# Altium schematic sheet ETHERNET.SchDoc
size A3; SheetNumber: 5; SheetTotal: 6
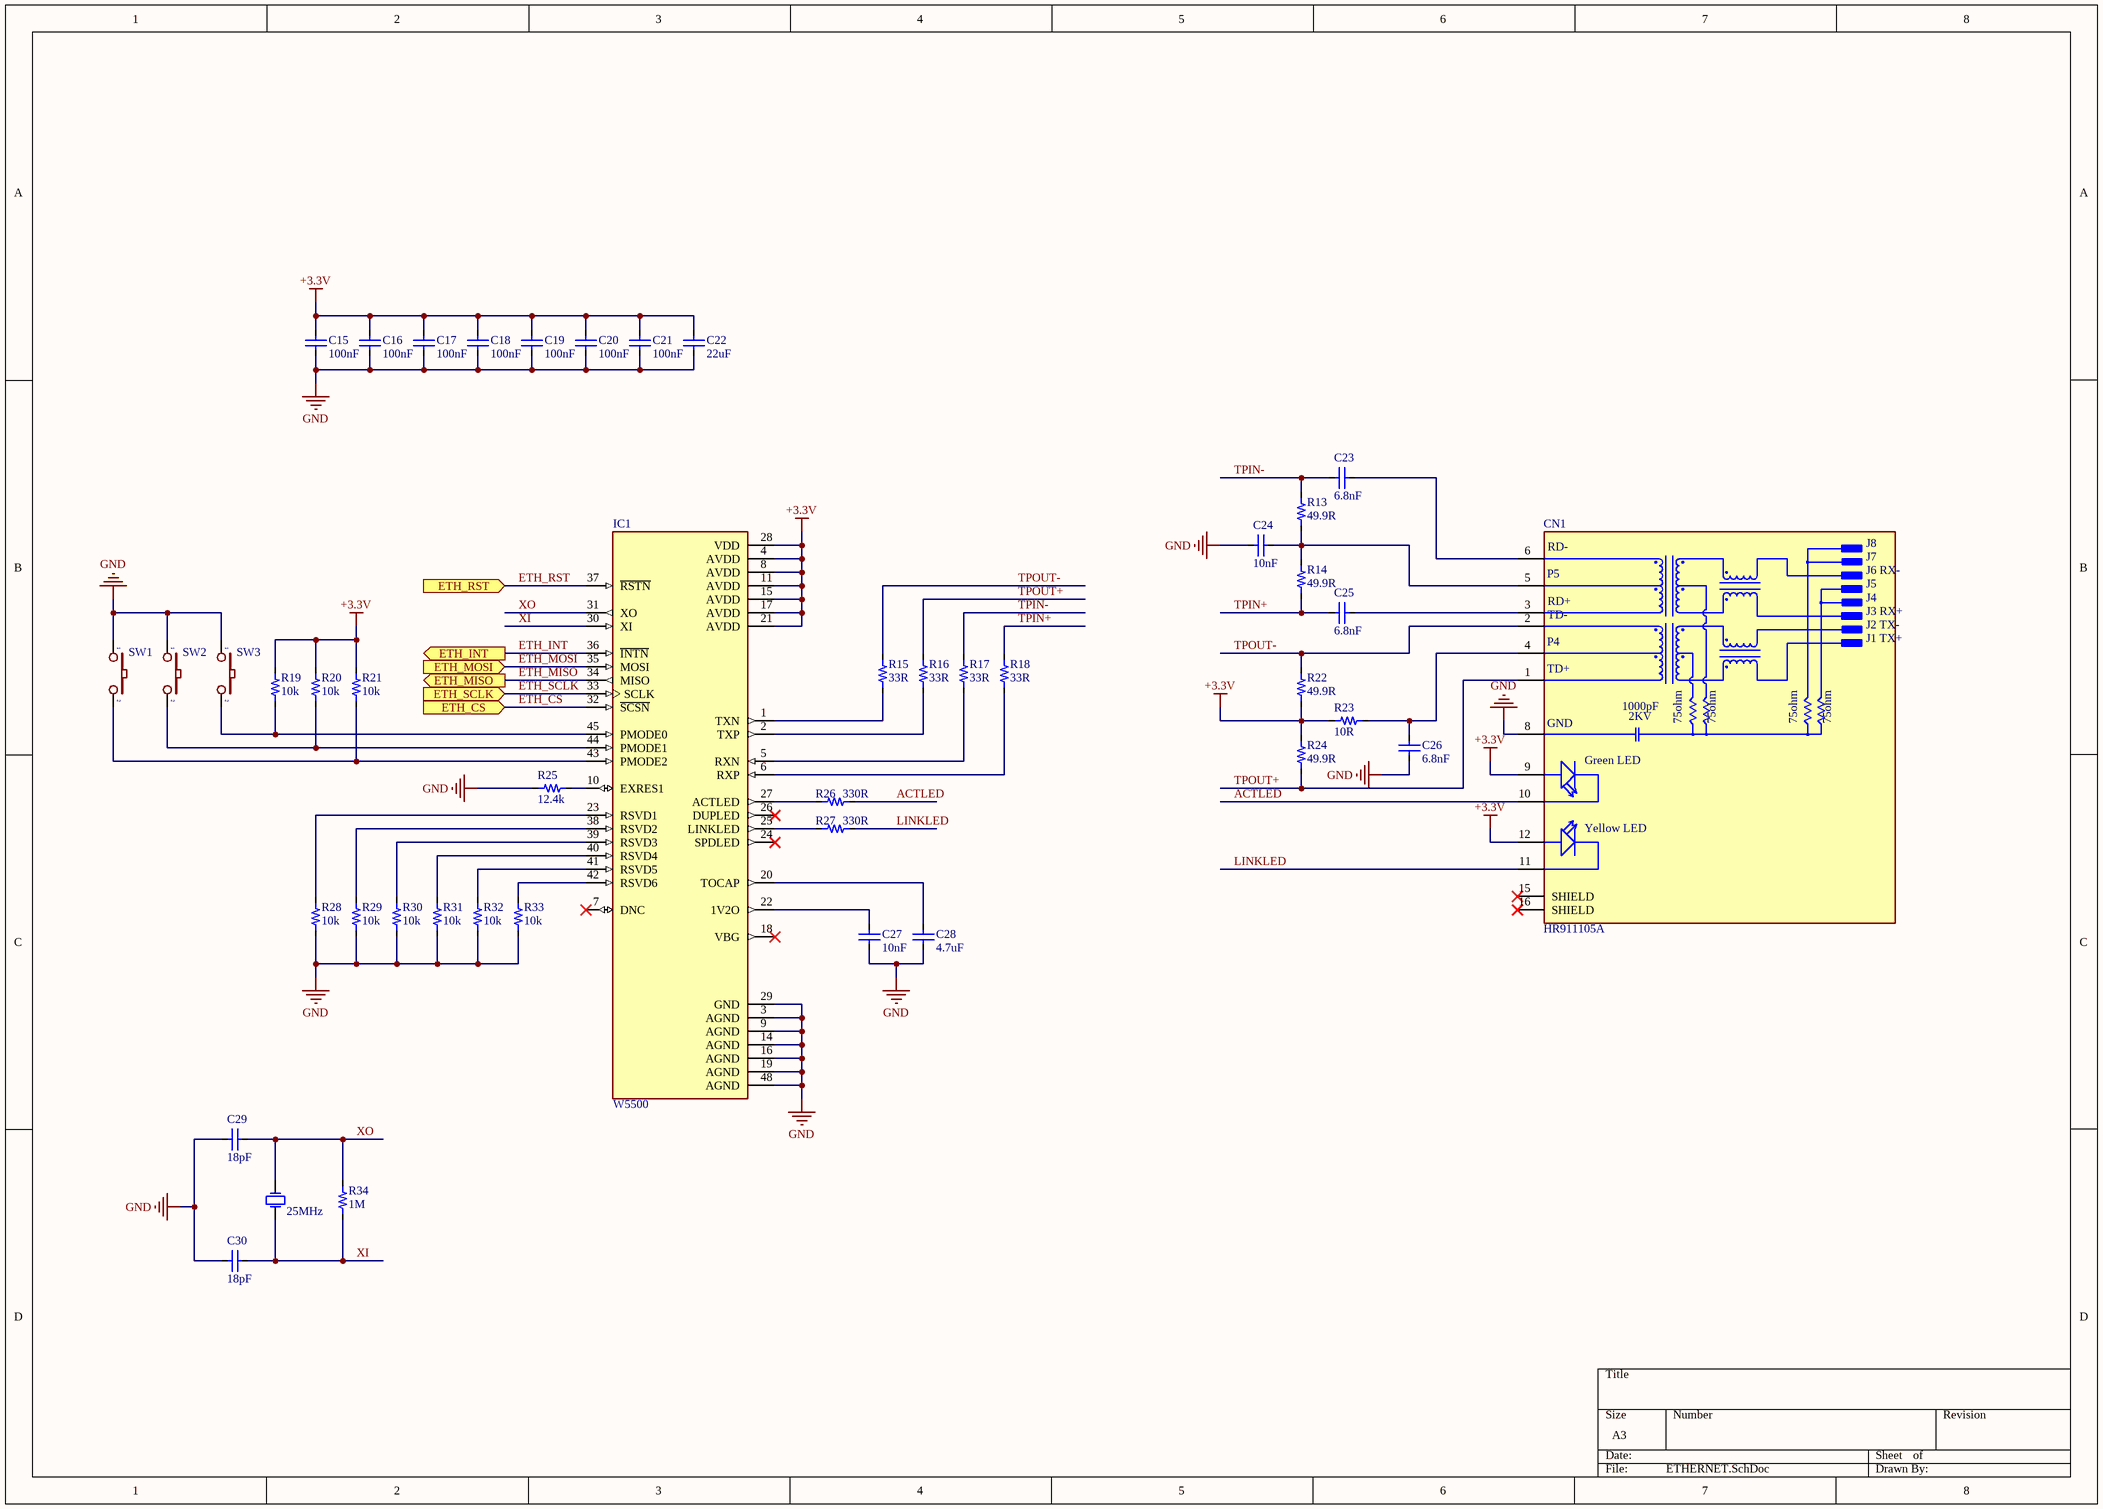
[diagram p0: ETHERNET.SchDoc]

## Parts
C15  100nF  [CAP_0603]
C16  100nF  [CAP_0603]
C17  100nF  [CAP_0603]
C18  100nF  [CAP_0603]
C19  100nF  [CAP_0603]
C20  100nF  [CAP_0603]
C21  100nF  [CAP_0603]
C22  22uF  [CAP_0603]
C23  6.8nF  [CAP_0603]
C24  10nF  [CAP_0603]
C25  6.8nF  [CAP_0603]
C26  6.8nF  [CAP_0603]
C27  10nF  [CAP_0603]
C28  4.7uF  [CAP_0603]
C29  18pF  [CAP_0603]
C30  18pF  [CAP_0603]
CN1  HR911105A  [HR911105A]
IC1  W5500  [W5500]
R13  49.9R  [RES-SMD-0603]
R14  49.9R  [RES-SMD-0603]
R15  33R  [RES-SMD-0603]
R16  33R  [RES-SMD-0603]
R17  33R  [RES-SMD-0603]
R18  33R  [RES-SMD-0603]
R19  10k  [RES-SMD-0603]
R20  10k  [RES-SMD-0603]
R21  10k  [RES-SMD-0603]
R22  49.9R  [RES-SMD-0603]
R23  10R  [RES-SMD-0603]
R24  49.9R  [RES-SMD-0603]
R25  12.4k  [RES-SMD-0603]
R26  330R  [RES-SMD-0603]
R27  330R  [RES-SMD-0603]
R28  10k  [RES-SMD-0603]
R29  10k  [RES-SMD-0603]
R30  10k  [RES-SMD-0603]
R31  10k  [RES-SMD-0603]
R32  10k  [RES-SMD-0603]
R33  10k  [RES-SMD-0603]
R34  1M  [RES-SMD-0603]
SW1  SW  [SW]  (value not drawn)
SW2  SW  [SW]  (value not drawn)
SW3  SW  [SW]  (value not drawn)
Y1  25MHz  [XTAL]

## Ports
ETH_CS (in), ETH_INT (out), ETH_MISO (out), ETH_MOSI (in), ETH_RST (in), ETH_SCLK (in)

## Nets
+3.3V: C15.1 C16.1 C17.1 C18.1 C19.1 C20.1 C21.1 C22.1 CN1.9(GA) CN1.12(YA) IC1.4(AVDD) IC1.8(AVDD) IC1.11(AVDD) IC1.15(AVDD) IC1.17(AVDD) IC1.21(AVDD) IC1.28(VDD) R19.2 R20.2 R21.2 R22.2 R23.1 R24.1
GND: C15.2 C16.2 C17.2 C18.2 C19.2 C20.2 C21.2 C22.2 C24.2 C26.2 C27.1 C28.1 C29.1 C30.1 CN1.8(GND) IC1.3(AGND) IC1.9(AGND) IC1.14(AGND) IC1.16(AGND) IC1.19(AGND) IC1.29(GND) IC1.48(AGND) R25.1 R28.1 R29.1 R30.1 R31.1 R32.1 R33.1 SW1.1 SW2.1 SW3.1
ACTLED: CN1.10(GC) R26.2
ETH_CS: IC1.32(~{SCSN}) ; port ETH_CS
ETH_INT: IC1.36(~{INTN}) ; port ETH_INT
ETH_MISO: IC1.34(MISO) ; port ETH_MISO
ETH_MOSI: IC1.35(MOSI) ; port ETH_MOSI
ETH_RST: IC1.37(~{RSTN}) ; port ETH_RST
ETH_SCLK: IC1.33(SCLK) ; port ETH_SCLK
LINKLED: CN1.11(YC) R27.2
TPIN+: C25.2 R14.2 R18.1
TPIN-: C23.2 R13.1 R17.1
TPOUT+: CN1.1(TD+) R16.1 R24.2
TPOUT-: CN1.2(TD-) R15.1 R22.1
XI: C30.2 IC1.30(XI) R34.1 Y1.2(OSC2)
XO: C29.2 IC1.31(XO) R34.2 Y1.1(OSC1)
NetC23_1: C23.1 CN1.6(RD-)
NetC24_1: C24.1 CN1.5(P5) R13.2 R14.1
NetC25_1: C25.1 CN1.3(RD+)
NetC26_1: C26.1 CN1.4(P4) R23.2
NetC27_2: C27.2 IC1.22(1V2O)
NetC28_2: C28.2 IC1.20(TOCAP)
NetIC1_1: IC1.1(TXN) R15.2
NetIC1_2: IC1.2(TXP) R16.2
NetIC1_5: IC1.5(RXN) R17.2
NetIC1_6: IC1.6(RXP) R18.2
NetIC1_10: IC1.10(EXRES1) R25.2
NetIC1_23: IC1.23(RSVD1) R28.2
NetIC1_25: IC1.25(LINKLED) R27.1
NetIC1_27: IC1.27(ACTLED) R26.1
NetIC1_38: IC1.38(RSVD2) R29.2
NetIC1_39: IC1.39(RSVD3) R30.2
NetIC1_40: IC1.40(RSVD4) R31.2
NetIC1_41: IC1.41(RSVD5) R32.2
NetIC1_42: IC1.42(RSVD6) R33.2
NetIC1_43: IC1.43(PMODE2) R21.1 SW1.2
NetIC1_44: IC1.44(PMODE1) R20.1 SW2.2
NetIC1_45: IC1.45(PMODE0) R19.1 SW3.2

Not connected (* = marked no-connect by the designer): CN1 15(SHIELD)* 16(SHIELD)*; IC1 7(DNC)* 18(VBG)* 24(SPDLED)* 26(DUPLED)*

## Notes on the sheet
- (in symbol HR911105A) J8; J7; J6 RX-; J5; J4; J3 RX+; J2 TX-; J1 TX+; 1000pF; 2KV; 75ohm; Green LED; Yellow LED

## Library data of the parts
C15-C30 = CapSMD: Capacitor; Value: 33p; Published: 8-Jun-2000; LatestRevisionDate: 17-Jul-2002; LatestRevisionNote: Re-released for DXP Platform.; PackageReference: RAD-0.3; Publisher: Altium Limited
R13-R34 = Resistor - SMD: Resistor; Manufacturer: Generic Components; Class: Passive; Published: 08/06/2000; Publisher: Altium Hobart Technology Centre
Y1 = XTAL: Crystal Oscillator; Published: 8-Jun-2000; LatestRevisionDate: 17-Jul-2002; LatestRevisionNote: Re-released for DXP Platform.; PackageReference: R38; Publisher: Altium Limited